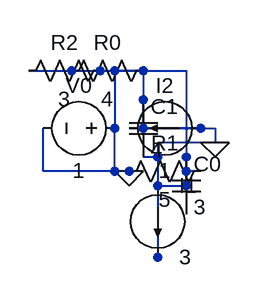
[diagram p0: schematic output.asc]
output.asc, the LTspice schematic file:
Version 4
SHEET 1 880 680
WIRE 80 176 256 176
WIRE 256 176 256 336
WIRE 192 240 288 240
WIRE 288 240 288 256
WIRE 208 272 224 272
WIRE 224 272 224 384
WIRE 288 256 224 256
WIRE 224 256 224 384
WIRE 224 304 256 304
WIRE 256 304 256 272
WIRE 272 288 256 288
WIRE 256 288 256 272
WIRE 208 176 176 176
WIRE 176 176 176 240
WIRE 192 288 176 288
WIRE 176 288 176 240
WIRE 192 288 176 288
WIRE 176 288 176 240
WIRE 192 288 96 288
WIRE 96 288 96 240
WIRE 128 176 208 176
WIRE 208 176 208 208
WIRE 272 240 208 240
WIRE 208 240 208 208
WIRE 160 176 208 176
WIRE 208 176 208 208
FLAG 288 256 0
FLAG 192 288 0
SYMBOL res 224 160 R90
SYMATTR InstName R0
SYMATTR Value 4
WINDOW 0 0 56 VBottom 2
WINDOW 3 32 56 VTop 2
SYMBOL res 288 272 R90
SYMATTR InstName R1
SYMATTR Value 5
WINDOW 0 0 56 VBottom 2
WINDOW 3 32 56 VTop 2
SYMBOL res 176 160 R90
SYMATTR InstName R2
SYMATTR Value 3
WINDOW 0 0 56 VBottom 2
WINDOW 3 32 56 VTop 2
SYMBOL cap 240 272 R0
SYMATTR InstName C0
SYMATTR Value 3
SYMBOL cap 192 208 R0
SYMATTR InstName C1
SYMATTR Value 4
SYMBOL voltage 192 240 R90
SYMATTR InstName V0
SYMATTR Value 1
WINDOW 0 -32 56 VBottom 2
WINDOW 3 32 56 VTop 2
WINDOW 123 0 0 VLeft 0
WINDOW 39 0 0 VLeft 0
SYMBOL current 224 304 R0
SYMATTR InstName I1
SYMATTR Value 3
SYMBOL current 272 240 R90
SYMATTR InstName I2
SYMATTR Value 1
WINDOW 0 -32 40 VBottom 2
WINDOW 3 32 40 VTop

The netlist it stands for:
* output.asc
R0 0 0 4
R1 0 0 5
R2 0 0 3
C0 0 0 3
C1 0 0 4
V0 0 0 1
I1 0 0 3
I2 0 0 1
.backanno
.end